# Altium schematic sheet ADC_DAC.SchDoc
size A3
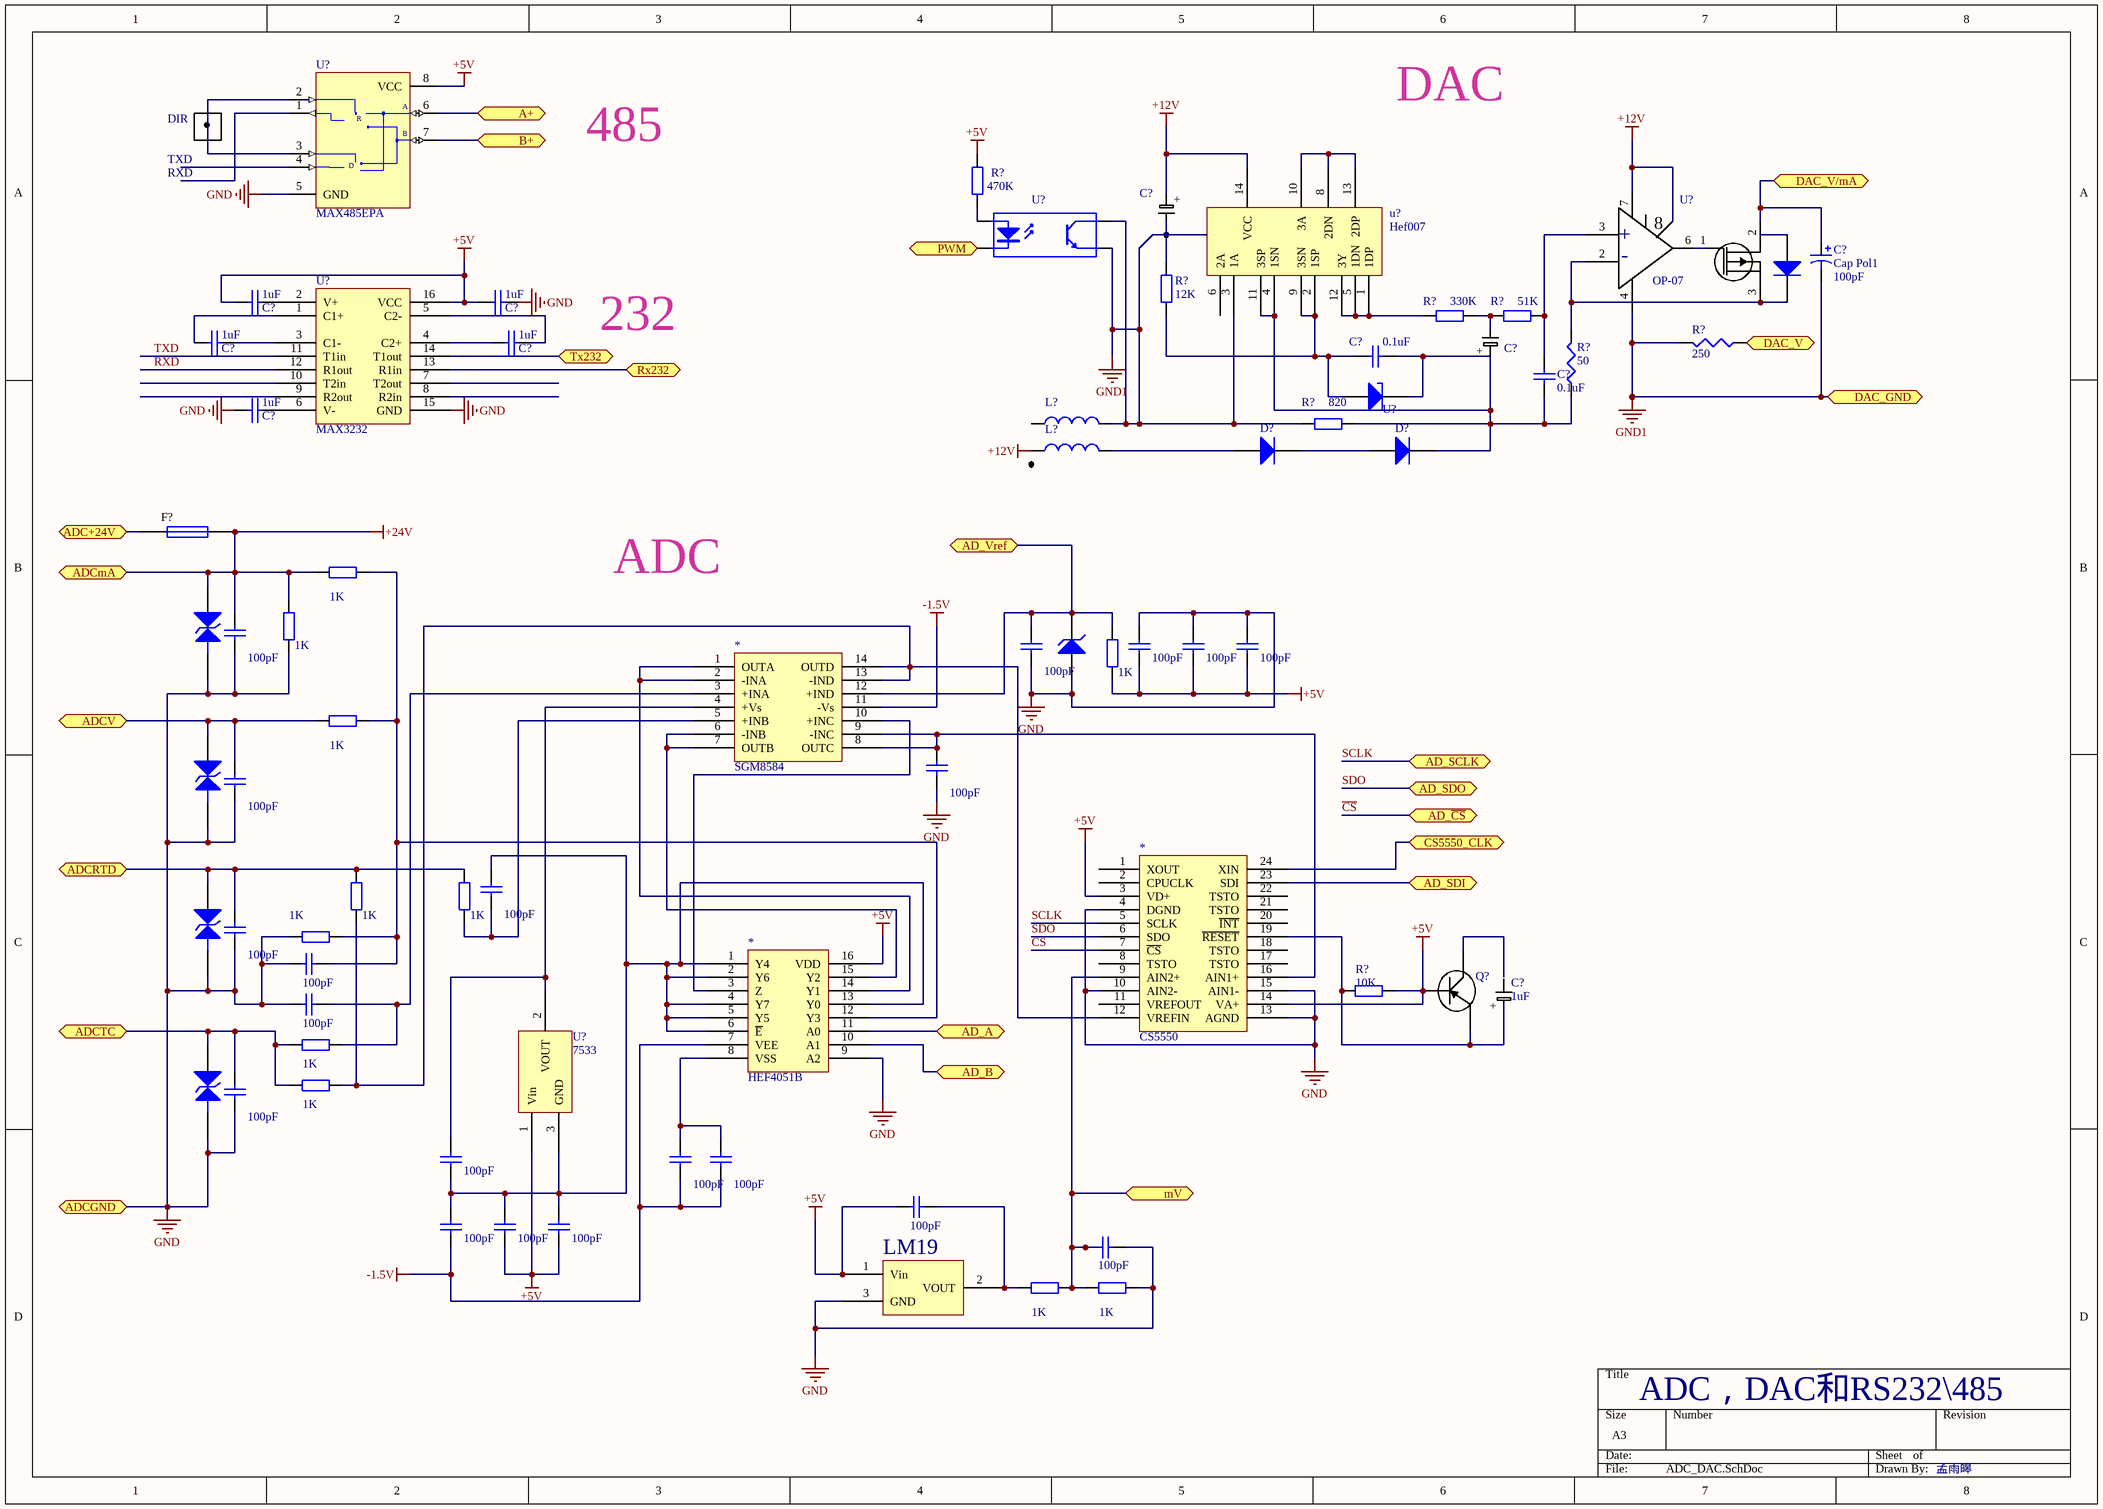
[diagram p0: ADC_DAC.SchDoc]

## Parts
(Parts that share a designator on the sheet are numbered #1, #2 ... from top to bottom, then left to right.)
*#1  ZENER3  (value not drawn)
*#2  SGM8584
*#3  CS5550
*#4  HEF4051B
*?#1  Component_1  (value not drawn)
*?#2  Component_1  (value not drawn)
*?#3  ZENER3  (value not drawn)
*?#4  ZENER3  (value not drawn)
*?#5  ZENER3  (value not drawn)
?#1  DIR
?#2  Component_1  (value not drawn)
?#3  Diode 1N4007  [D#1]  (value not drawn)
C?#1  Component_1  (value not drawn)
C?#2  Cap Pol1  value 100pF  [RB7.6-15]
C?#3  1uF  [0603C]
C?#4  1uF  [0603C]
C?#5  Component_1  (value not drawn)
C?#6  value 0.1uF  [RAD-0.3]  (hidden comment: Cap)
C?#7  1uF  [0603C]
C?#8  1uF  [0603C]
C?#9  value 0.1uF  [RAD-0.3]  (hidden comment: Cap)
C?#10  1uF  [0603C]
C?#11  value 100pF  [RAD-0.3]  (hidden comment: Cap)
C?#12  value 100pF  [RAD-0.3]  (hidden comment: Cap)
C?#13  value 100pF  [RAD-0.3]  (hidden comment: Cap)
C?#14  value 100pF  [RAD-0.3]  (hidden comment: Cap)
C?#15  value 100pF  [RAD-0.3]  (hidden comment: Cap)
C?#16  value 100pF  [RAD-0.3]  (hidden comment: Cap)
C?#17  value 100pF  [RAD-0.3]  (hidden comment: Cap)
C?#18  value 100pF  [RAD-0.3]  (hidden comment: Cap)
C?#19  value 100pF  [RAD-0.3]  (hidden comment: Cap)
C?#20  value 100pF  [RAD-0.3]  (hidden comment: Cap)
C?#21  1uF
C?#22  value 100pF  [RAD-0.3]  (hidden comment: Cap)
C?#23  value 100pF  [RAD-0.3]  (hidden comment: Cap)
C?#24  value 100pF  [RAD-0.3]  (hidden comment: Cap)
C?#25  value 100pF  [RAD-0.3]  (hidden comment: Cap)
C?#26  value 100pF  [RAD-0.3]  (hidden comment: Cap)
C?#27  value 100pF  [RAD-0.3]  (hidden comment: Cap)
C?#28  value 100pF  [RAD-0.3]  (hidden comment: Cap)
C?#29  value 100pF  [RAD-0.3]  (hidden comment: Cap)
C?#30  value 100pF  [RAD-0.3]  (hidden comment: Cap)
C?#31  value 100pF  [RAD-0.3]  (hidden comment: Cap)
D?#1  Diode 1N4007  [D#1]  (value not drawn)
D?#2  Diode 1N4007  [D#1]  (value not drawn)
D?#3  D Zener  [DIODE-0.7]  (value not drawn)
F?  12  [PIN-W2/E2.8]  (value not drawn)
L?#1  IHLP2525CZER6R8M01/6.8UH  [IHLP2525CZER6R8M01/6.8UH]  (value not drawn)
L?#2  IHLP2525CZER6R8M01/6.8UH  [IHLP2525CZER6R8M01/6.8UH]  (value not drawn)
Q#?  IRF3205  [irf3205]  (value not drawn)
Q?#1  8550  (value not drawn)
Q?#2  LM19
R?#1  value 470K  [AXIAL-0.4]  (hidden comment: Res2)
R?#2  value 12K  [AXIAL-0.4]  (hidden comment: Res2)
R?#3  value 330K  [AXIAL-0.4]  (hidden comment: Res2)
R?#4  value 51K  [AXIAL-0.4]  (hidden comment: Res2)
R?#5  value 250  [J1-0603]  (hidden comment: Res3)
R?#6  value 50  [J1-0603]  (hidden comment: Res3)
R?#7  value 820  [AXIAL-0.4]  (hidden comment: Res2)
R?#8  value 1K  [AXIAL-0.4]  (hidden comment: Res2)
R?#9  value 1K  [AXIAL-0.4]  (hidden comment: Res2)
R?#10  value 1K  [AXIAL-0.4]  (hidden comment: Res2)
R?#11  value 1K  [AXIAL-0.4]  (hidden comment: Res2)
R?#12  value 1K  [AXIAL-0.4]  (hidden comment: Res2)
R?#13  value 1K  [AXIAL-0.4]  (hidden comment: Res2)
R?#14  value 1K  [AXIAL-0.4]  (hidden comment: Res2)
R?#15  value 10K  [AXIAL-0.4]  (hidden comment: Res2)
R?#16  value 1K  [AXIAL-0.4]  (hidden comment: Res2)
R?#17  value 1K  [AXIAL-0.4]  (hidden comment: Res2)
R?#18  value 1K  [AXIAL-0.4]  (hidden comment: Res2)
R?#19  value 1K  [AXIAL-0.4]  (hidden comment: Res2)
U?#1  MAX485EPA  [PA8]
U?#2  Optoisolator1  [DIP-4]  (value not drawn)
U?#3  OP-07
u?#4  Hef007
U?#5  MAX3232  [max3232]
U?#6  SBR3U40P1  [SBR3U40P1]  (value not drawn)
U?#7  7533

## Ports
A+, AD_A, AD_B, AD_SCLK, AD_SDI, AD_SDO, AD_Vref, AD_~{CS}, ADC+24V, ADCGND, ADCmA, ADCRTD, ADCTC, ADCV, B+, CS5550_CLK, DAC_GND, DAC_V, DAC_V/mA, mV, PWM, Rx232, Tx232

## Nets
+5V: *#3.3(VD+) *#3.14(VA+) *#4.16(VDD) C?#3.1 C?#4.1 C?#13.1 C?#14.1 C?#15.1 C?#27.1 C?#29.1 C?#30.1 Q?#1.7 Q?#2.1(Vin) R?#1.2 R?#10.1 R?#15.2 U?#1.8(VCC) U?#5.16(VCC) U?#7.1(Vin)
+12V: L?#2.1 U?#3.7 u?#4.14(VCC)
+24V: *#1.2(K) C?#11.2 F?.2 R?#8.1 R?#9.2 ; port ADCmA
-1.5V: *#2.11(-Vs) *#4.7(VEE) C?#25.1 C?#26.1 C?#28.1
GND: *#1.1(A) *#3.4(DGND) *#3.10(AIN2-) *#3.13(AGND) *#3.15(AIN1-) *#4.9(A2) *?#3.1(A) *?#4.1(A) *?#5.1(A) C?#4.2 C?#10.1 C?#11.1 C?#12.1 C?#13.2 C?#14.2 C?#15.2 C?#16.1 C?#17.1 C?#19.1 C?#20.1 C?#22.1 C?#23.1 C?#31.1 D?#3.1(A) Q?#2.3(GND) R?#9.1 R?#14.1 R?#19.2 U?#1.5(GND) U?#5.15(GND) ; port ADCGND
GND1: C?#2.2 L?#1.2 R?#5.2 R?#7.1 U?#2.3(E) U?#2.4(C) U?#3.4 u?#4.3(1A) ; port DAC_GND
A+: U?#1.6(A) ; port A+
AD_A: *#4.11(A0) ; port AD_A
AD_B: *#4.10(A1) ; port AD_B
AD_SDI: *#3.23(SDI) ; port AD_SDI
AD_Vref: *#2.12(+IND) C?#12.2 D?#3.2(K) R?#10.2 ; port AD_Vref
ADC+24V: F?.1 ; port ADC+24V
ADCRTD: *?#4.2(K) C?#19.2 R?#12.1 R?#13.2 ; port ADCRTD
ADCTC: *?#5.2(K) C?#23.2 R?#16.1 R?#17.1 ; port ADCTC
ADCV: *?#3.2(K) C?#17.2 R?#11.1 ; port ADCV
B+: U?#1.7(B) ; port B+
~{CS}: *#3.7(~{CS}) ; port AD_~{CS}
CS5550_CLK: *#3.24(XIN) ; port CS5550_CLK
DAC_V: R?#5.1 ; port DAC_V
DAC_V/mA: C?#2.1 Q#?.2(D) ; port DAC_V/mA
mV: *#3.9(AIN2+) C?#31.2 R?#18.2 R?#19.1 ; port mV
PWM: U?#2.2(K) ; port PWM
Rx232: U?#5.13(R1in) ; port Rx232
RXD: U?#5.12(R1out)
SCLK: *#3.5(SCLK) ; port AD_SCLK
SDO: *#3.6(SDO) ; port AD_SDO
Tx232: U?#5.14(T1out) ; port Tx232
TXD: U?#5.11(T1in)
Net*#2_1: *#2.1(OUTA) *#2.2(-INA) *#4.14(Y1)
Net*#2_3: *#2.3(+INA) C?#22.2 R?#16.2
Net*#2_4: *#2.4(+Vs) C?#24.2 U?#7.2(VOUT)
Net*#2_5: *#2.5(+INB) C?#18.1 R?#13.1
Net*#2_6: *#2.6(-INB) *#2.7(OUTB) *#4.15(Y2)
Net*#2_8: *#2.8(OUTC) *#2.9(-INC) *#3.16(AIN1+) C?#16.2
Net*#2_10: *#2.10(+INC) *#4.3(Z)
Net*#2_13: *#2.13(-IND) *#2.14(OUTD) *#3.12(VREFIN) R?#12.2 R?#17.2
Net*#3_19: *#3.19(~{RESET}) Q?#1.8 R?#15.1
Net*#4_1: *#4.1(Y4) *#4.2(Y6) *#4.4(Y7) *#4.5(Y5) *#4.6(~{E}) *#4.13(Y0) C?#18.2 C?#24.1 C?#28.2 C?#29.2 C?#30.2 U?#7.3(GND)
Net*#4_8: *#4.8(VSS) C?#25.2 C?#26.2
Net*#4_12: *#4.12(Y3) C?#20.2 R?#8.2 R?#11.2 R?#14.2
Net?#3_2: ?#3.2(K) Q#?.3(S) R?#6.2 U?#3.2
NetC?#3_2: C?#3.2 U?#5.2(V+)
NetC?#6_1: C?#6.1 R?#2.1 u?#4.2(1SP) u?#4.9(3SN) U?#6.1(A)
NetC?#6_2: C?#6.2 C?#9.1 D?#2.2(K) R?#6.1 R?#7.2 u?#4.4(1SN) u?#4.11(3SP) U?#6.2(K)
NetC?#7_1: C?#7.1 U?#5.1(C1+)
NetC?#7_2: C?#7.2 U?#5.3(C1-)
NetC?#8_1: C?#8.1 U?#5.4(C2+)
NetC?#8_2: C?#8.2 U?#5.5(C2-)
NetC?#9_2: C?#9.2 R?#4.2 U?#3.3
NetC?#10_2: C?#10.2 U?#5.6(V-)
NetC?#27_2: C?#27.2 Q?#2.2(VOUT) R?#18.1
NetD?#1_1: D?#1.1(A) L?#2.2
NetD?#1_2: D?#1.2(K) D?#2.1(A)
NetQ#?_1: Q#?.1 U?#3.6
NetR?#1_1: R?#1.1 U?#2.1(A)
NetR?#3_1: R?#3.1 u?#4.1(1DP) u?#4.5(1DN) u?#4.12(3Y)
NetR?#3_2: R?#3.2 R?#4.1
NetU?#1_2: U?#1.2(~{RE}) U?#1.3(DE)
Netu?#4_8: u?#4.8(2DN) u?#4.10(3A) u?#4.13(2DP)

Not connected (* = marked no-connect by the designer): *#3 1(XOUT) 2(CPUCLK) 8(TSTO) 11(VREFOUT) 17(TSTO) 18(TSTO) 20(~{INT}) 21(TSTO) 22(TSTO); ?#3 1(A); L?#1 1; Q?#1 9; R?#2 2; U?#1 1(RO) 4(DI); U?#3 17; u?#4 6(2A); U?#5 7(T2out) 8(R2in) 9(R2out) 10(T2in)

## Notes on the sheet
- DAC
- (near ?#1) TXD
- RXD
- 485
- 232
- ADC
- ADC，DAC和RS232\485
- 孟雨皞
- (in symbol Component_1) +
- (in symbol MAX485EPA) R; D
- (in symbol 方框) .
- (in symbol 运放) 8; +; -

## Library data of the parts
?#1 = 方框
?#3 D?#1 D?#2 = Diode 1N4007: 1 Amp General Purpose Rectifier; Published: 8-Jun-2000; LatestRevisionDate: 17-Jul-2002; LatestRevisionNote: Re-released for DXP Platform.; DatasheetDocument: 1998; PackageDocument: Aug-1999; PackageReference: DO-41; Publisher: Altium Limited; Code_JEDEC: DO-204-AL; ComponentLink1Description: Manufacturer Link; ComponentLink1URL: http://www.fairchildsemi.com/; ComponentLink2Description: Datasheet; ComponentLink2URL: http://www.fairchildsemi.com/ds/1N%2F1N4001.pdf
C?#2 = Cap Pol1: Polarized Capacitor (Radial); Published: 8-Jun-2000; LatestRevisionDate: 17-Jul-2002; LatestRevisionNote: Re-released for DXP Platform.; PackageReference: RB7.6-15; Publisher: Altium Limited; PackageDescription: Polarized Capacitor (Radial); 2 Leads
C?#3 C?#4 C?#7 C?#8 C?#10 = CAP: Capacitor
C?#6 C?#9 C?#11-C?#20 C?#22-C?#31 = Cap: Capacitor; Published: 8-Jun-2000; LatestRevisionDate: 17-Jul-2002; LatestRevisionNote: Re-released for DXP Platform.; PackageReference: RAD-0.3; Publisher: Altium Limited; PackageDescription: Radial Cap, Thru-Hole; 2 Leads; 0.3 in Pin Spacing
C?#21 Q?#2 u?#4 U?#7 = Component_1
D?#3 = D Zener: Zener Diode; Published: 8-Jun-2000; LatestRevisionDate: 17-Jul-2002; LatestRevisionNote: Re-released for DXP Platform.; PackageReference: DIODE-0.7; Publisher: Altium Limited; PackageDescription: Diode, Thru-Hole; 2 Leads; 0.7 in Pin Spacing
F? = Fuse 1: Fuse; Published: 8-Jun-2000; LatestRevisionDate: 17-Jul-2002; LatestRevisionNote: Re-released for DXP Platform.; PackageReference: PIN-W2/E2.8; Publisher: Altium Limited; PackageDescription: Thru-Hole; 2 Leads
L?#1 L?#2 = Inductor: Code_IEC: 1005; Value: 4.7uh; Published: 8-Jun-2000; LatestRevisionDate: 17-Jul-2002; LatestRevisionNote: Re-released for DXP Platform.; PackageReference: 0402-A; Publisher: Altium Limited; Code_JEITA: 0402
Q#? = PMOS1: N-Channel Power MOSFET; Note: Pin 2 is electrically connected to pin 4.; Published: 8-Jun-2000; LatestRevisionDate: 17-Jul-2002; LatestRevisionNote: Re-released for DXP Platform.; DatasheetVersion: PD-9.814; PackageReference: TO-220AB; Publisher: Altium Limited; Code_JEDEC: TO-220-AB; ComponentLink1Description: Manufacturer Link; ComponentLink1URL: http://www.irf.com/
R?#1-R?#4 R?#7-R?#19 = Res2: Resistor; Published: 8-Jun-2000; LatestRevisionDate: 17-Jul-2002; LatestRevisionNote: Re-released for DXP Platform.; PackageReference: AXIAL-0.4; Publisher: Altium Limited
  R?#8-R?#14 R?#16-R?#19: PackageDescription: Axial Device, Thru-Hole; 2 Leads; 0.4 in Pin Spacing
R?#5 R?#6 = Res3: Resistor; Published: 8-Jun-2000; LatestRevisionDate: 04-Mar-2005; LatestRevisionNote: PCB Footprint replaced.; PackageReference: J1-0603; Publisher: Altium Limited
U?#1 = MAX485EPA: Low-Power, Slew-Rate-Limited RS-485/RS-422 Transceiver; Published: 16-Jan-2001; LatestRevisionDate: 29-May-2009; LatestRevisionNote: Component Body Added.; DatasheetVersion: Feb-1996; PackageVersion: RevB, 21-0043; PackageReference: PA8; Publisher: Altium Limited; PackageDescription: DIP, 8-Pin, Row Spacing 7.62 mm, Pitch 2.54 mm; Code_JEDEC: MS-001-AB; ComponentLink1Description: Manufacturer Link; ComponentLink1URL: http://www.maxim-ic.com/; ComponentLink2Description: Datasheet; ComponentLink2URL: http://pdfserv.maxim-ic.com/en/ds/MAX1487-MAX491.pdf
U?#2 = Optoisolator1: 4-Pin Phototransistor Optocoupler; Published: 24-Mar-1999; LatestRevisionDate: 04-Mar-2005; LatestRevisionNote: Sch pins 3 & 4 Swapped.; DatasheetVersion: Nov-2003; PackageReference: DIP-4; Publisher: Altium Limited
U?#3 = 运放
U?#6 = 稳压管: Zener Diode; Published: 8-Jun-2000; LatestRevisionDate: 17-Jul-2002; LatestRevisionNote: Re-released for DXP Platform.; PackageReference: DIODE-0.7; Publisher: Altium Limited